# EAGLE design multi_sense (EAGLE 9.6.2)
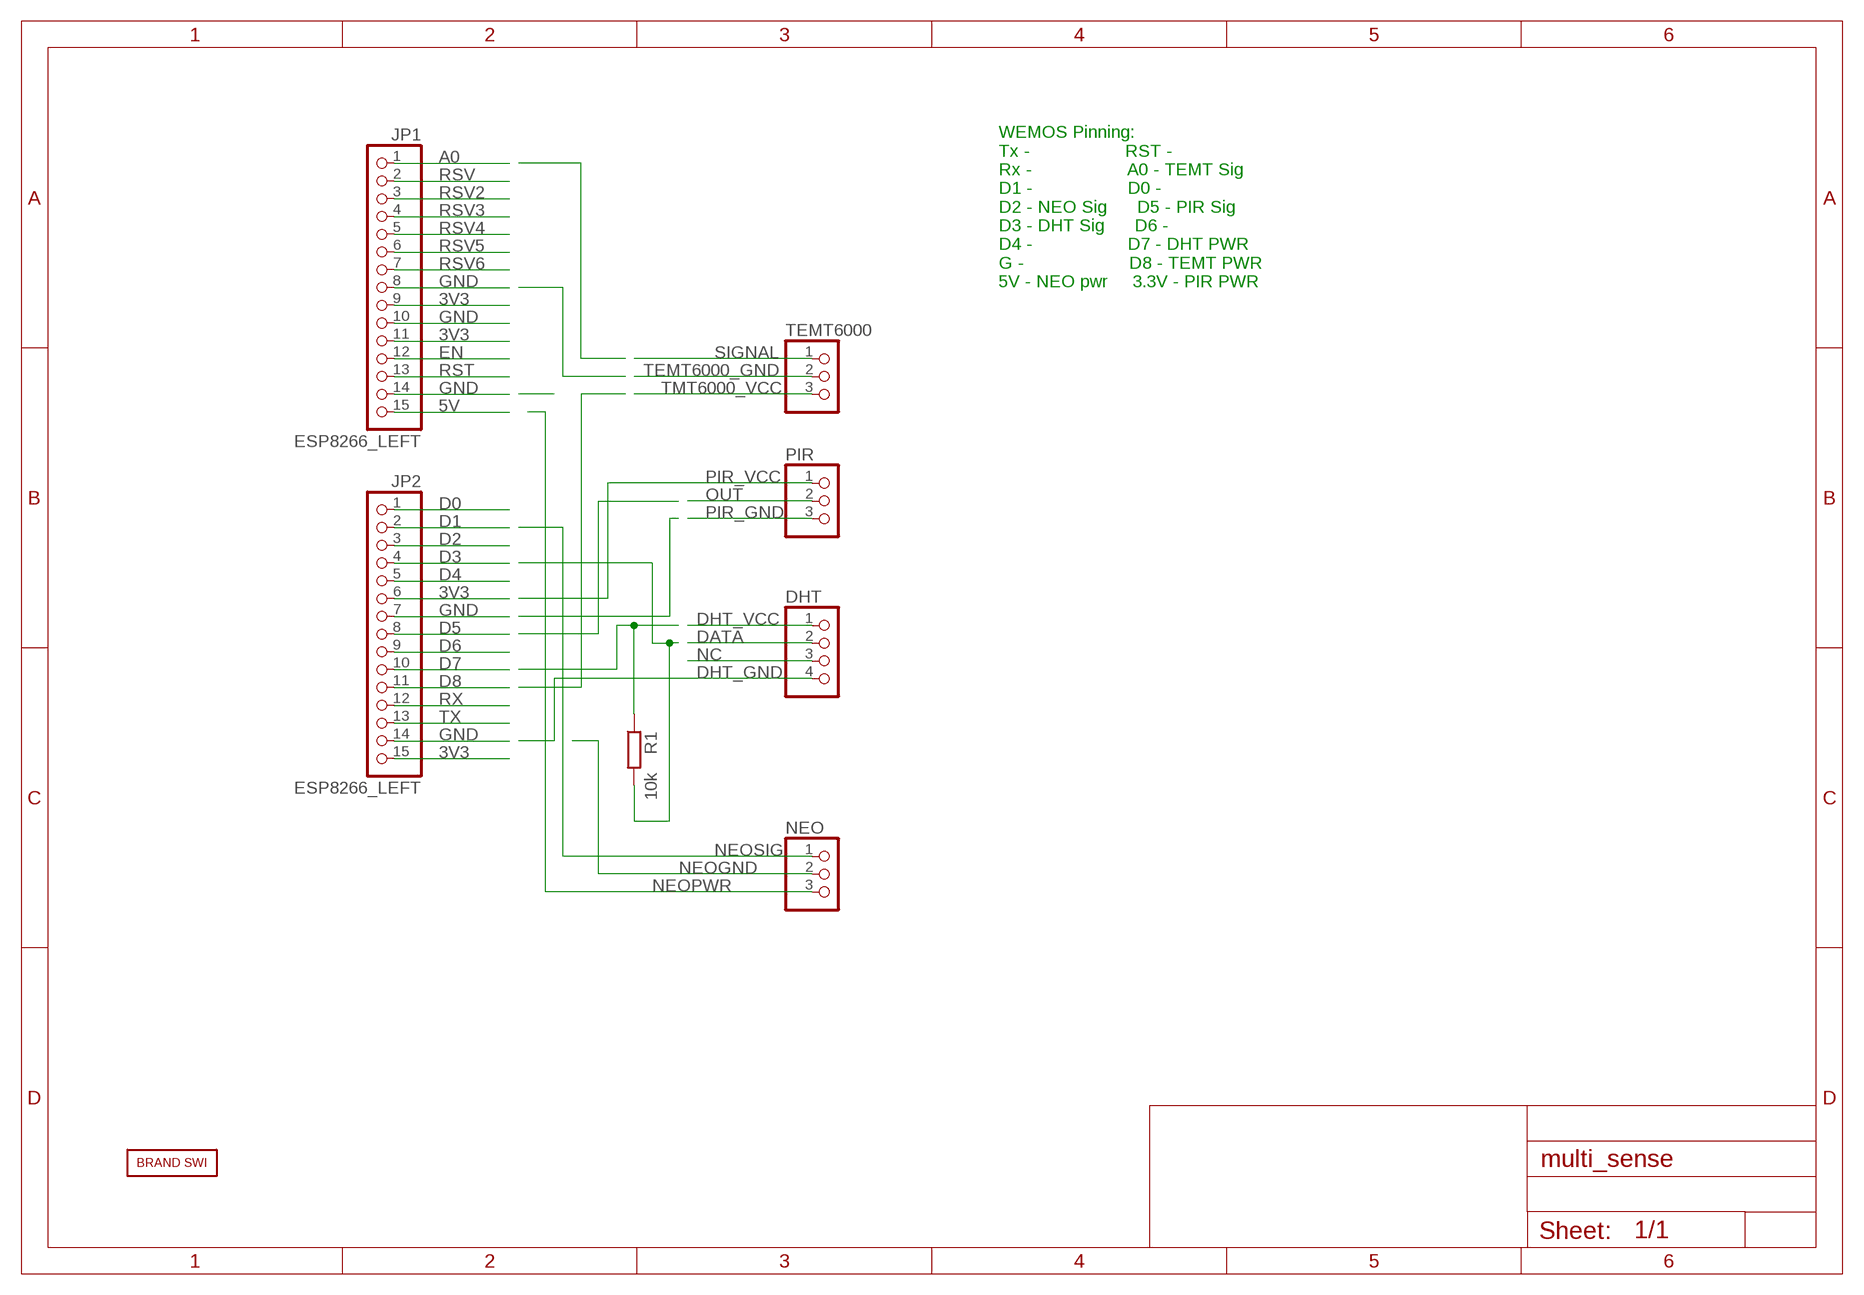
[diagram p0: schematic, sheet 1]

## Parts
DHT  PINHD-1X4  [1X04]
JP1  ESP8266_LEFT  PINHD-1X15  [1X15]
JP2  ESP8266_LEFT  PINHD-1X15  [1X15]
NEO  PINHD-1X3  [1X03]
PIR  PINHD-1X3  [1X03]
R1  10k  R-EU_0207/10  [0207/10]
TEMT6000  PINHD-1X3  [1X03]
U$2  BRAND_SWI5X7  [BRAND_SWI_5X7]

## Nets
3V3: JP1.9 JP1.11 JP2.6 JP2.15
5V: JP1.15
A0: JP1.1
D0: JP2.1
D1: JP2.2
D2: JP2.3
D3: JP2.4
D4: JP2.5
D5: JP2.8
D6: JP2.9
D7: JP2.10
D8: JP2.11
DATA: DHT.2
DHT_GND: DHT.4
DHT_VCC: DHT.1
EN: JP1.12
GND: JP1.8 JP1.10 JP1.14 JP2.7 JP2.14
N$1: R1.2
N$3: R1.1
NC: DHT.3
NEOGND: NEO.2
NEOPWR: NEO.3
NEOSIG: NEO.1
OUT: PIR.2
PIR_GND: PIR.3
PIR_VCC: PIR.1
RST: JP1.13
RSV: JP1.2
RSV2: JP1.3
RSV3: JP1.4
RSV4: JP1.5
RSV5: JP1.6
RSV6: JP1.7
RX: JP2.12
SIGNAL: TEMT6000.1
TEMT6000_GND: TEMT6000.2
TMT6000_VCC: TEMT6000.3
TX: JP2.13

## Notes on the sheet
- WEMOS Pinning:
  Tx -                   RST - 
  Rx -                   A0 - TEMT Sig
  D1 -                   D0 - 
  D2 - NEO Sig      D5 - PIR Sig
  D3 - DHT Sig      D6 - 
  D4 -                   D7 - DHT PWR
  G -                     D8 - TEMT PWR
  5V - NEO pwr     3.3V - PIR PWR

## Library data of the parts
DHT = pinhead:PINHD-1X4: PIN HEADER
JP1 JP2 = pinhead:PINHD-1X15: PIN HEADER
NEO PIR TEMT6000 = pinhead:PINHD-1X3: PIN HEADER
R1 = rcl:R-EU_: RESISTOR, European symbol
U$2 = BRAND_SWI:BRAND_SWI

## Board
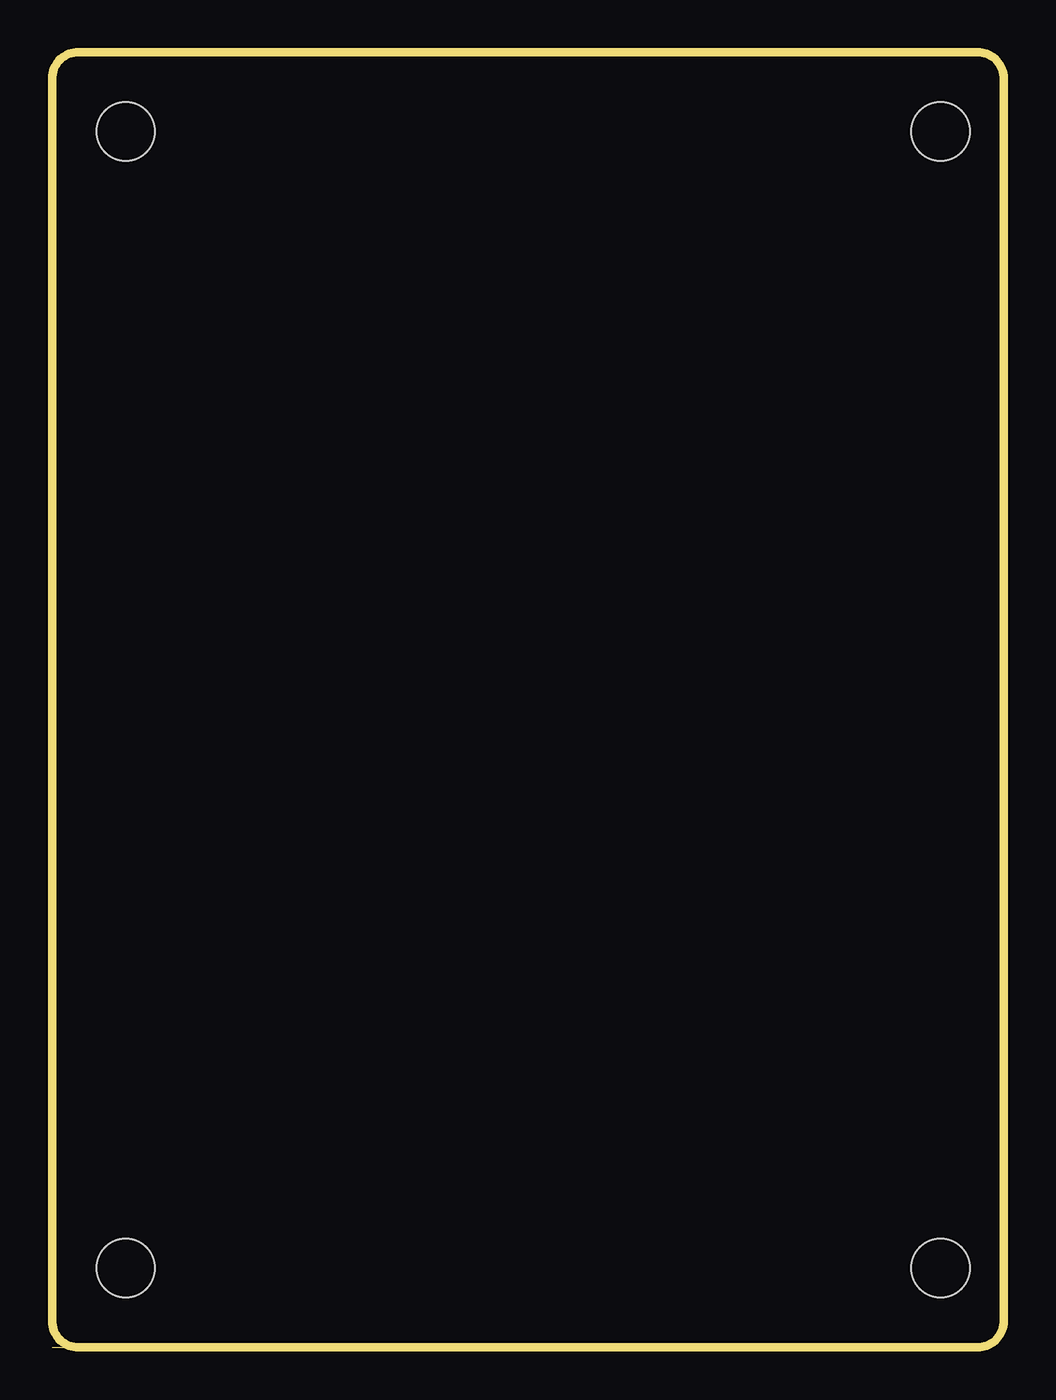
[diagram p1: board, top side]
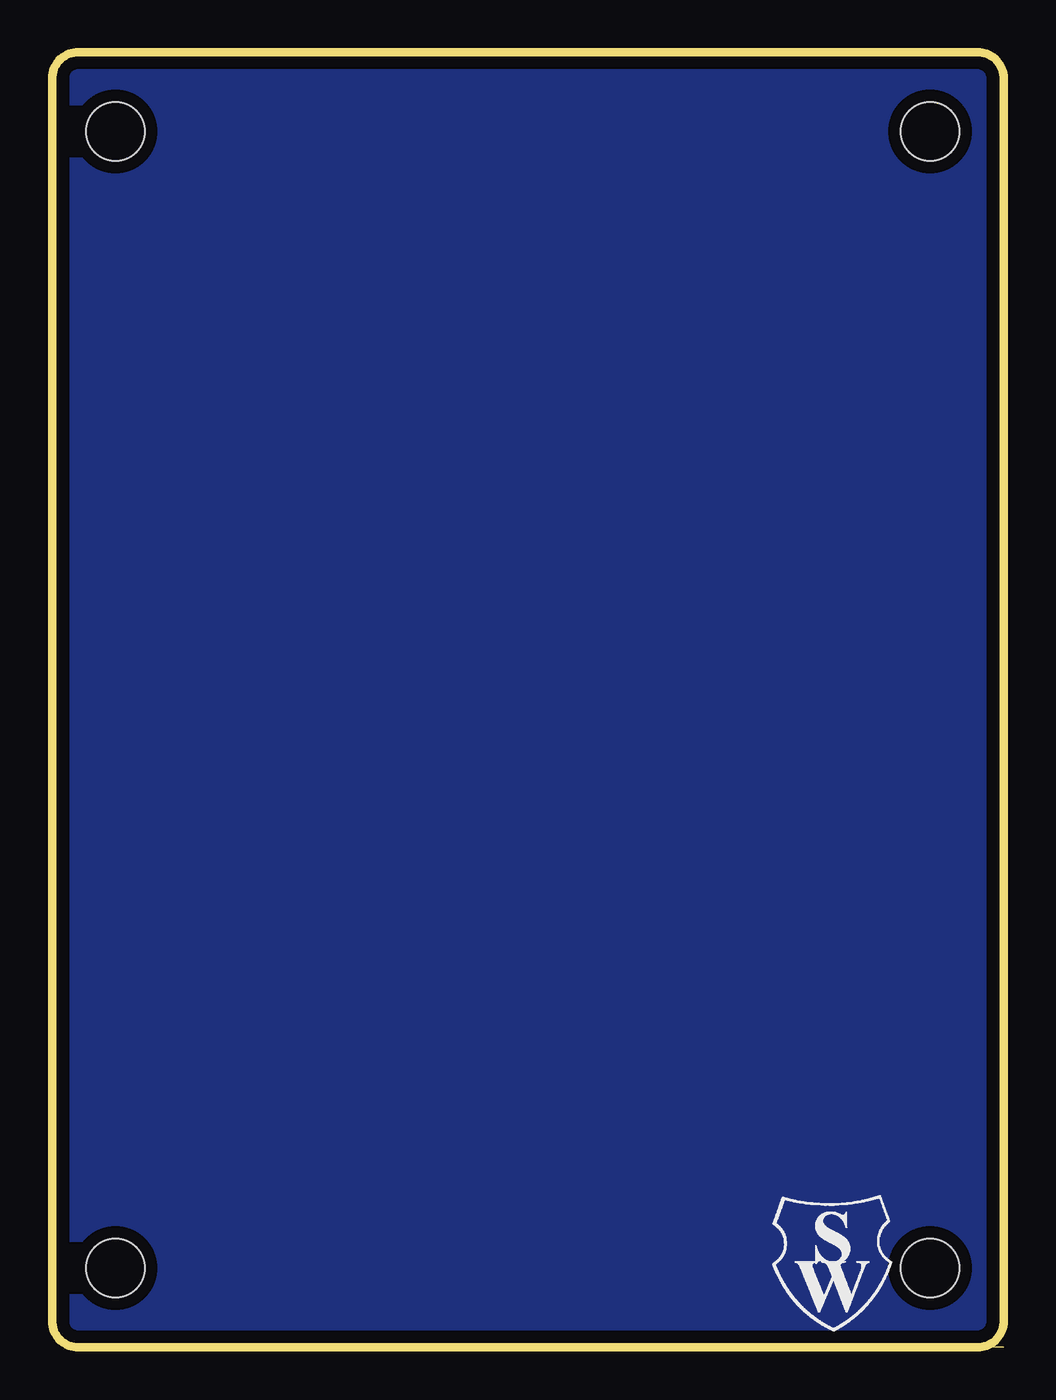
[diagram p2: board, bottom side, seen from below]

Size 45.72 x 62.23 mm. Coordinates in mm from the lower left corner, seen from the top.
Outline: 0,0 1.27,0
Outline: 1.27,0 2.03,0
Outline: 28.45,0 31.42,0
Outline: 1.27,0 44.45,0 arc90 45.72,1.27 45.72,60.96 arc90 44.45,62.23 1.27,62.23 arc90 0,60.96 0,1.27 arc90 1.27,0
Copper layers (1*16): Top 0.035mm / dielectric 1.6mm / Bottom 0.035mm
Design rules "Elecrow_2-layer_PCB_eagle_rule *": minimum track width 12mil, minimum drill 12mil, track to track 6mil, track to pad 6mil, pad to pad 6mil, via to via 8mil, smd to smd 0mil, copper to edge 20mil, drill to drill 10mil, minimum pad ring 6mil, minimum via ring 6mil, stop-mask expansion 0mil, vias tented up to drill 100mil, thermal gap 10mil
Holes 2.8 mm at 3.54,58.42 42.68,58.42 42.68,3.81 3.54,3.81

### Footprints (pad centres in the part's own frame; a part is rotated, then mirrored left to right if it is on the bottom)
1X04 = drill 1.016 long: 1 -3.81,0; 2 -1.27,0; 3 1.27,0; 4 3.81,0
1X15 = drill 1.016 long: 1 -17.78,0; 2 -15.24,0; 3 -12.7,0; 4 -10.16,0; 5 -7.62,0; 6 -5.08,0; 7 -2.54,0; 8 0,0; 9 2.54,0; 10 5.08,0; 11 7.62,0; 12 10.16,0; 13 12.7,0; 14 15.24,0; 15 17.78,0
1X03 = drill 1.016 long: 1 -2.54,0; 2 0,0; 3 2.54,0
0207/10 = drill 0.813 octagon: 1 -5.08,0; 2 5.08,0

### Placement (x,y rotation side)
DHT  11.43,-306.07 0 top  (outside the outline)
JP1  25.4,-336.55 0 top  (outside the outline)
JP2  25.4,-351.79 0 top  (outside the outline)
NEO  4.45,-359.41 0 top  (outside the outline)
PIR  10.16,-290.83 0 top  (outside the outline)
R1  10.79,-130.81 0 top  (outside the outline)
TEMT6000  10.16,-321.31 0 top  (outside the outline)
U$2  11.3,0.64 0 bottom

### Tracks (layer width: path | path; a pad name or v marks a point on that pad's centre or on a via)
3V3  (3 unrouted)
DGND
  pour Bottom (isolate 0.61): 0,59.69 arc-90 2.54,62.23 3.81,62.23 43.18,62.23 arc-90 45.72,59.69 45.72,2.54 arc-90 43.18,0 41.91,0 1.27,0 arc-90 0,1.27 0,2.54
GND  (4 unrouted)

### Text on the board
bRestrict: PN39022R1B1 | WSHIELD_MCP_BASIC